# Altium schematic sheet STeaMi-FP7-Port_extention.SchDoc
size A3; DocumentNumber: 1; SheetNumber: 8; SheetTotal: 16
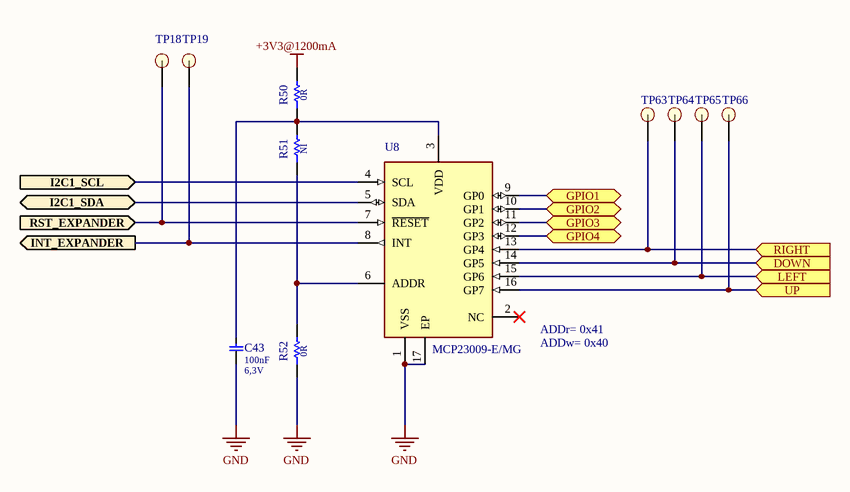
[diagram p0: STeaMi-FP7-Port_extention.SchDoc]

## Parts
C43  Capacitance: 100nF  Voltage: 6,3V  [0402-CAP]
R50  Resistance: 0R  [RESC1005X40N_0402]
R51  (no value)  [RESC1005X40N_0402]
R52  Resistance: 0R  [RESC1005X40N_0402]
TP18  PAD  [Testpoint 1mm]  (value not drawn)  (no BOM)
TP19  PAD  [Testpoint 1mm]  (value not drawn)  (no BOM)
TP63  PAD  [Testpoint 1mm]  (value not drawn)  (no BOM)
TP64  PAD  [Testpoint 1mm]  (value not drawn)  (no BOM)
TP65  PAD  [Testpoint 1mm]  (value not drawn)  (no BOM)
TP66  PAD  [Testpoint 1mm]  (value not drawn)  (no BOM)
U8  (no value)  [QFN50P300X300X100-17N-D]

## Ports
DOWN (in), GPIO1 (bidir), GPIO2 (bidir), GPIO3 (bidir), GPIO4 (bidir), I2C1_SCL (in), I2C1_SDA (bidir), INT_EXPANDER (out), LEFT (in), RIGHT (in), RST_EXPANDER (in), UP (in)

## Nets
+3V3@1200mA: R50.2
GND: C43.1 R52.1 U8.1(VSS) U8.17(EP)
DOWN: TP64.1 U8.14(GP5) ; port DOWN
GPIO1: U8.9(GP0) ; port GPIO1
GPIO2: U8.10(GP1) ; port GPIO2
GPIO3: U8.11(GP2) ; port GPIO3
GPIO4: U8.12(GP3) ; port GPIO4
I2C1_SCL: U8.4(SCL) ; port I2C1_SCL
I2C1_SDA: U8.5(SDA) ; port I2C1_SDA
INT_EXPANDER: TP19.1 U8.8(INT) ; port INT_EXPANDER
LEFT: TP65.1 U8.15(GP6) ; port LEFT
RIGHT: TP63.1 U8.13(GP4) ; port RIGHT
RST_EXPANDER: TP18.1 U8.7(~{RESET}) ; port RST_EXPANDER
UP: TP66.1 U8.16(GP7) ; port UP
NetC43_2: C43.2 R50.1 R51.2 U8.3(VDD)
NetR51_1: R51.1 R52.2 U8.6(ADDR)

Not connected (* = marked no-connect by the designer): U8 2(NC)*

## Notes on the sheet
- (near U8) ADDr= 0x41
- (near U8) ADDw= 0x40
- Le présent document est la propriété exclusive de SmartEmbed. Remis à titre confidentiel, il ne peut être communiqué
- IND
- DATE
- DESCRIPTION
- VISA
- à des tiers, ni utilisé ou reproduit qu'en stricte conformité d'autorisations expresses préalables.
- Etabli le:
- Verifié le:
- Validé le:
- Par:
- Page:
- /
- Pépinière CleanTech Domaine du Petit Arbois Avenue Louis Philibert BP 80058 13792 AIX-EN-PROVENCE CEDEX 3
- REFERENCE
- DESIGNATION

## Library data of the parts
C43 = 100nF-10%-6,3V-X5R-0402: CAP CER 100nF 6,3V X5R 0402; Manufacturer: Kyocera AVX; Manufacturer Part Number: 0402YD104KAT2A; Populated: True; std Package: 0402; Tolerence: 0,1; Vérification: Non; Created by: EAG; Creation Date: 18/10/2021; Checked by: *; Part Number: 100nF-10%-6,3V-X5R-0402; Dielectric: X5R; Digikey: 478-1126-1-ND; Mouser: 581-0402YD104K; Switch possibility: True
R50 R52 = 0R-5%-0,0625W-0402: RES CMS 0R5%-0,0625W-0402; Manufacturer: Yageo; Manufacturer Part Number: RC0402JR-100RL; Populated: True; Power: 0,0625; Nom vérificateur: Non; Prix: 0,09; std Package: 0402; Tolerence: 0,05; Created by: EAG; Creation Date: 02/12/2021; Part Number: 0R-5%-0,0625W-0402; Mouser: 603-RC0402JR-100RL; Switch possibility: True
R51 = NI-1%-0,1W-0603: NI; Populated: True; Power: 0,1; Nom vérificateur: Non; std Package: 0603; Tolerence: 0,01; Created by: MSA; Creation Date: 20/03/2019; Manufacturer: -; Manufacturer Part Number: -; Resistance: NI; Part Number: NI-1%-0,1W-0603; Digikey: -; Farnell: -; Mouser: -; RS: -; Switch possibility: True
TP18 TP19 = TESTPOINTPAD: Manufacturer: Smartembed; Switch possibility: False; Vérification: Non; Package: PAD_TEST; Part Number: TESTPOINTPAD; Created by: EAG; Creation Date: 11/03/2020; Digikey: -; Farnell: -; Manufacturer Part Number: TESTPOINT; Mouser: -; RS: -
TP63-TP66 = TESTPOINTPAD: Manufacturer: SmartEmbed; Package: PAD_TEST; Part Number: TESTPOINTPAD
U8 = MCP23009-E/MG: Interface - Extensions d'E/S 8B I/O Expander I2C interface; Manufacturer: Microchip; Populated: False; Switch possibility: False; Vérification: Non; Created by: EAG; Creation Date: 13/09/2021; Checked by: *; Ambient Temperature: ='Ambient temp'; Storage temperature: ='Storage temp'; Current: *; RoHs compliant: ='Rohs'; Datasheet: ='Datasheet'; Manufacturer Part Number: MCP23009-E/MG; Part Number: MCP23009-E/MG; Mouser: 579-MCP23009-E/MG